# Altium project ESC.PrjPcb
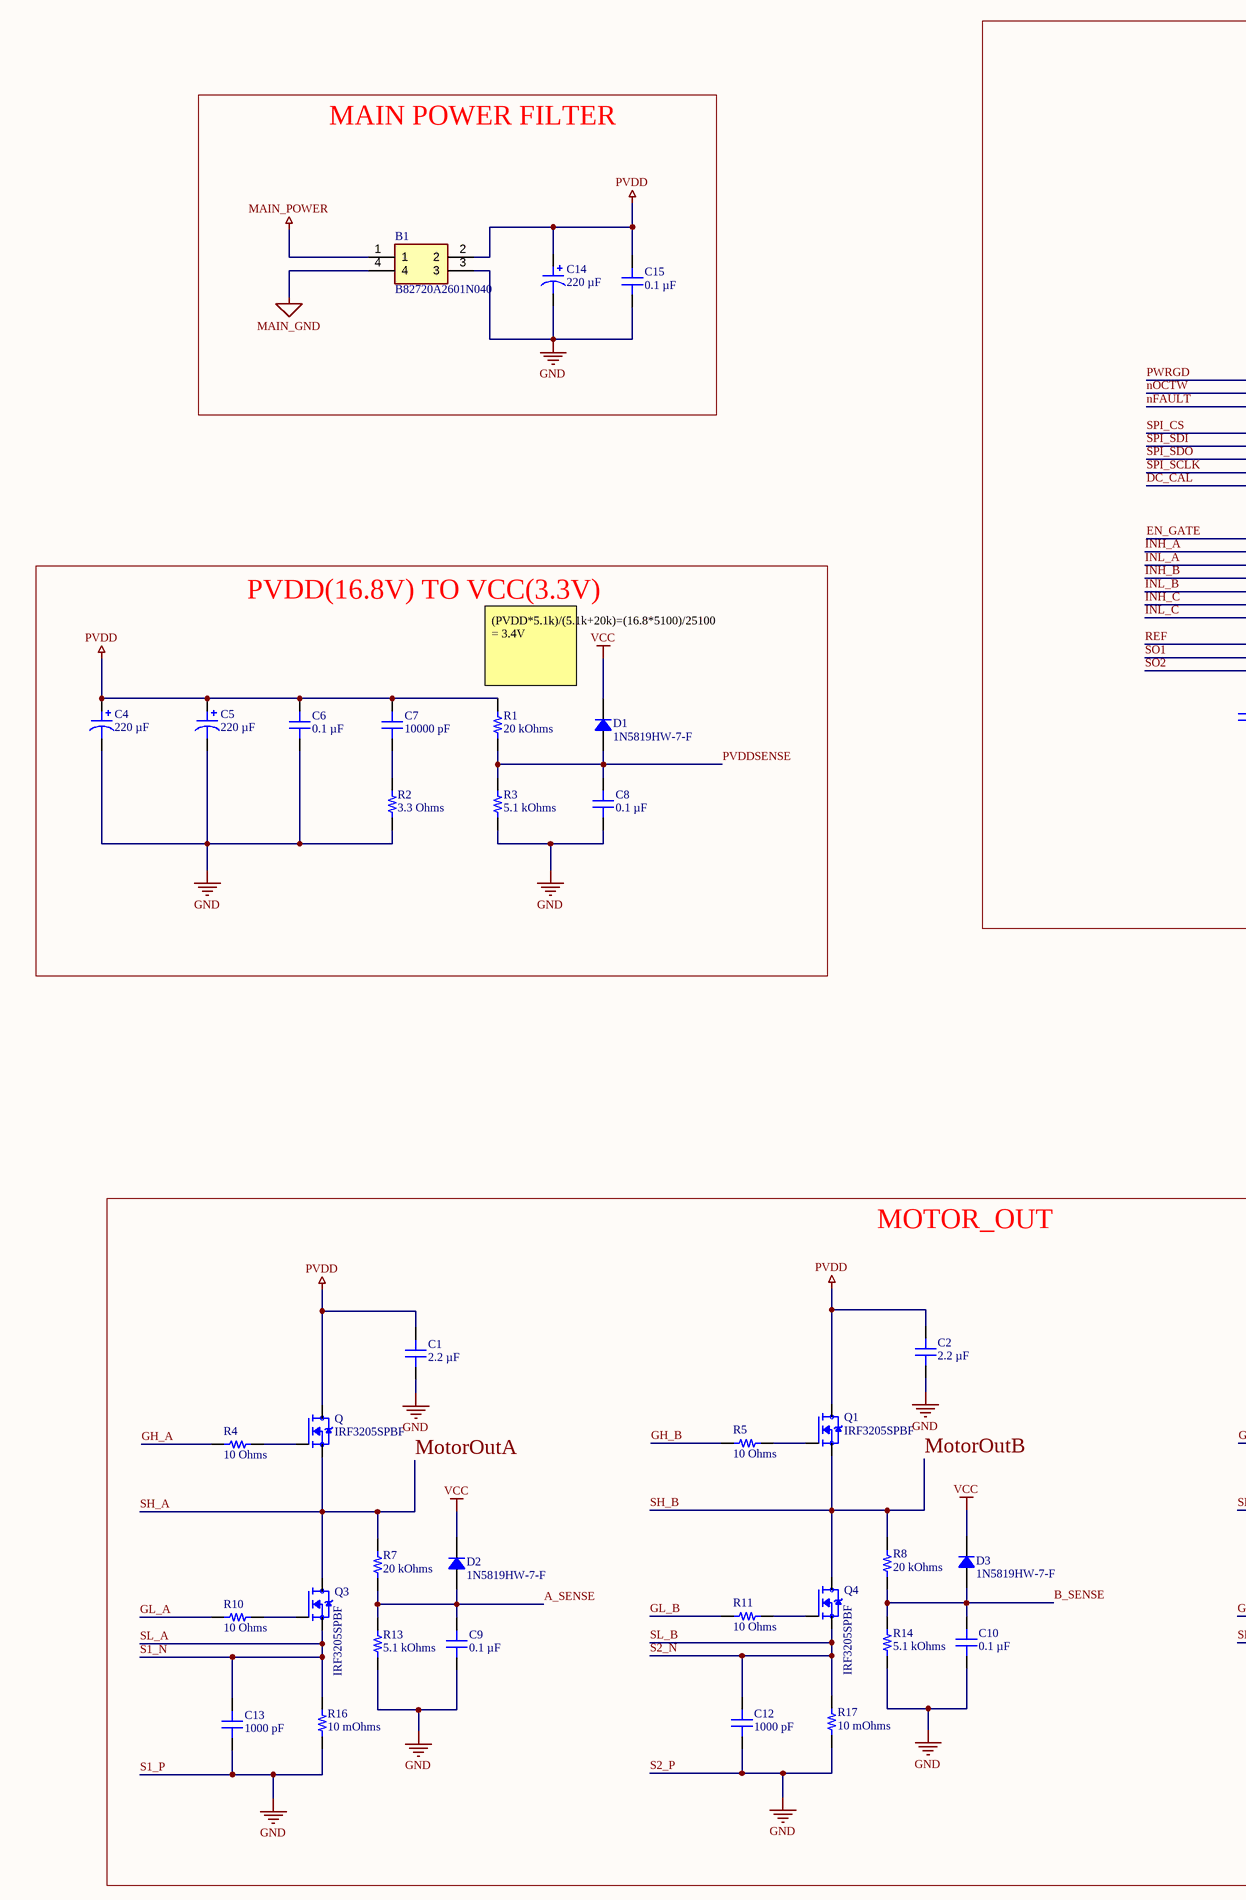
[diagram p0: Sheet1.SchDoc, left]
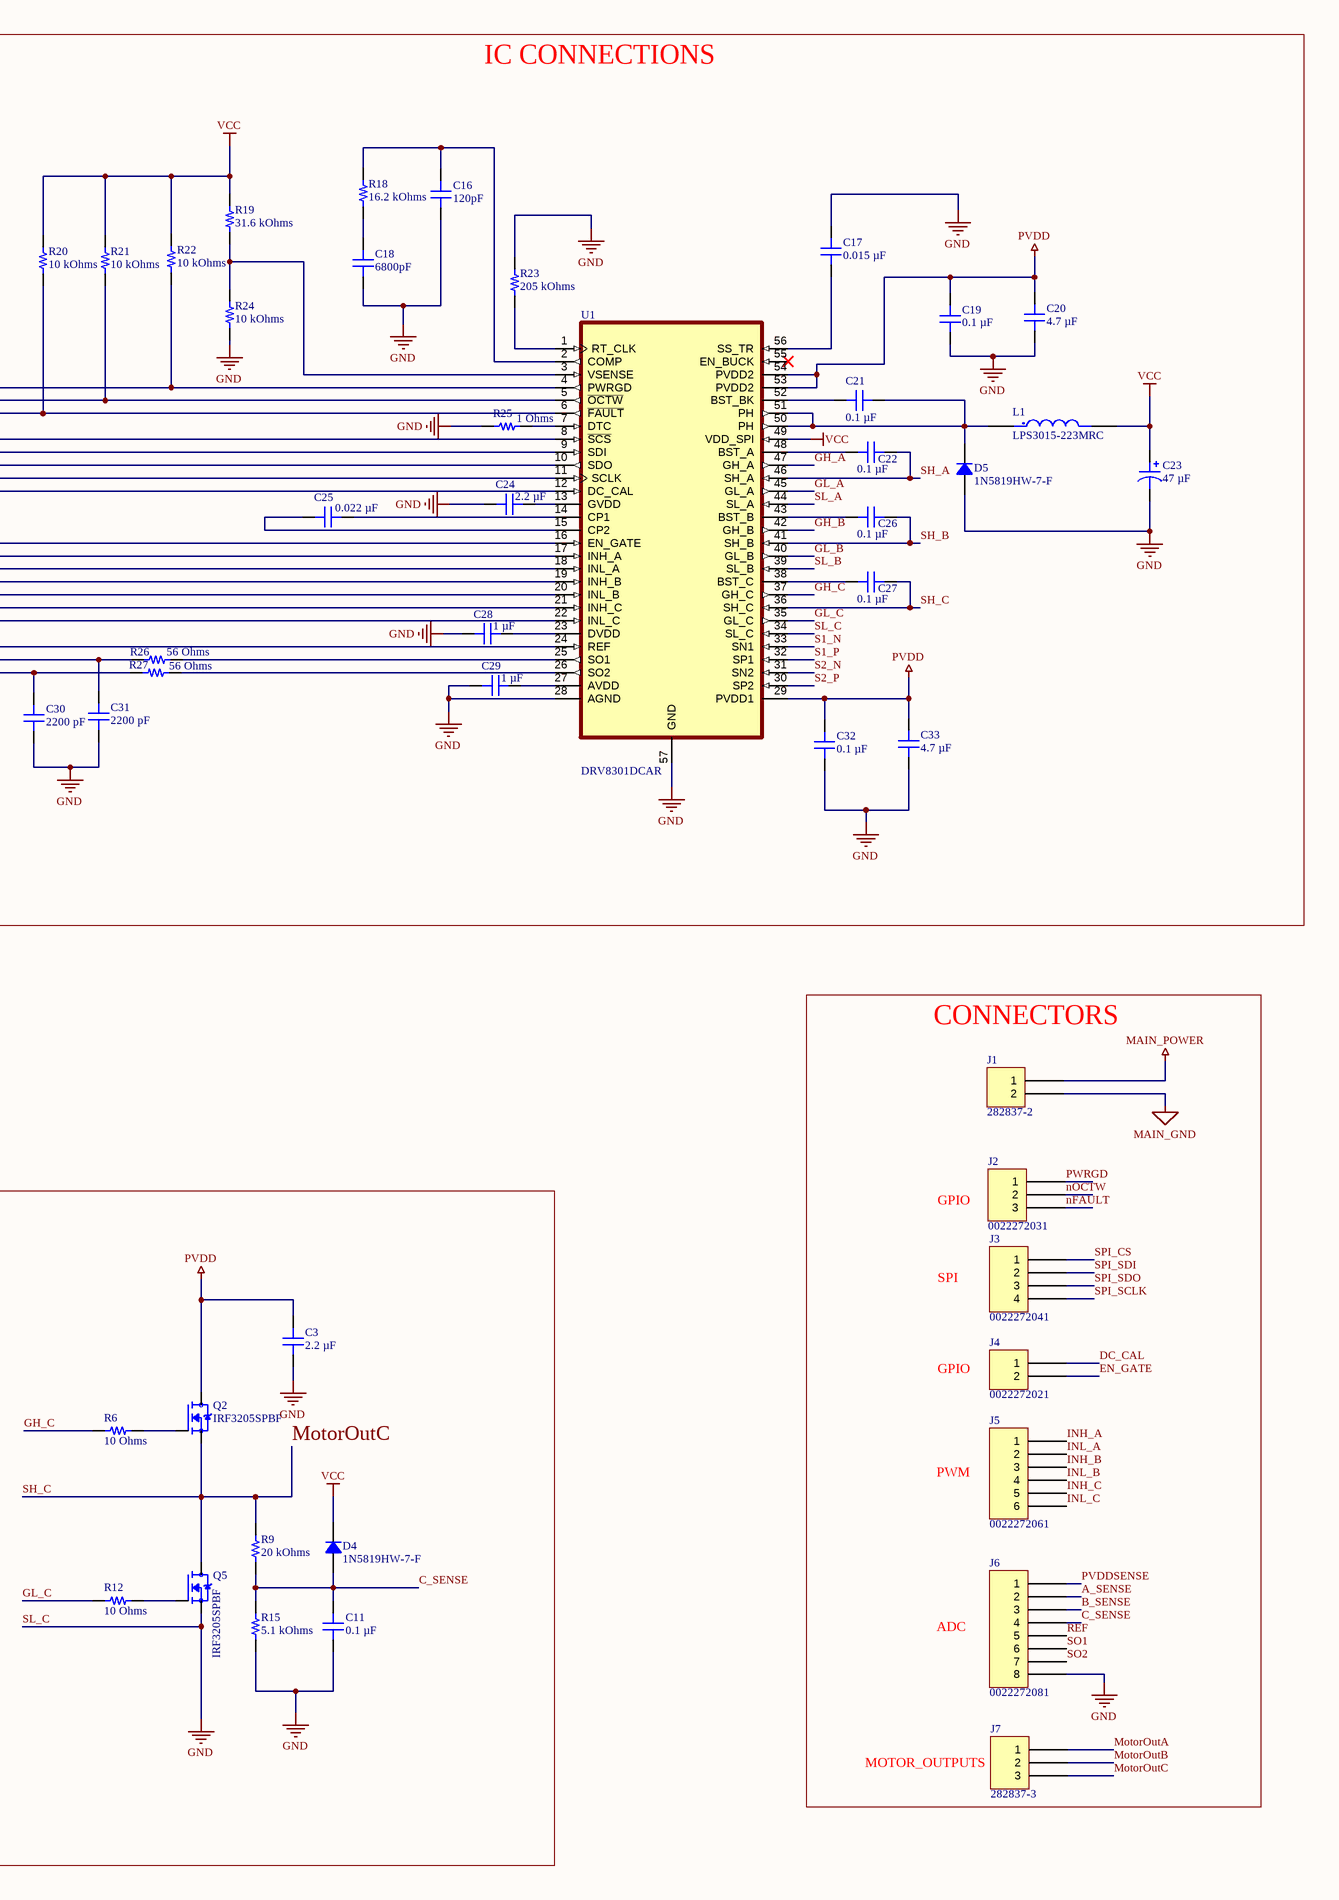
[diagram p1: Sheet1.SchDoc, right]
1 sheet, 81 parts. Net scope: global (net labels, ports and power ports of the same name join across sheets).
Board file: PCB1.PcbDoc

## Sheet Sheet1.SchDoc
size 558 x 431 mm; SheetNumber: 1; SheetTotal: 1

### Parts
B1  B82720A2601N040  [B82720A2601N040]
C1  2.2 µF  [CAP 0805_2012]
C2  2.2 µF  [CAP 0805_2012]
C3  2.2 µF  [CAP 0805_2012]
C4  220 µF  [CAP ALSMD 8.3MM H10.5MM]
C5  220 µF  [CAP ALSMD 8.3MM H10.5MM]
C6  0.1 µF  [CAP 0805_2012]
C7  10000 pF  [CAP 0805_2012]
C8  0.1 µF  [CAP 0805_2012]
C9  0.1 µF  [CAP 0805_2012]
C10  0.1 µF  [CAP 0805_2012]
C11  0.1 µF  [CAP 0805_2012]
C12  1000 pF  [CAP 0805_2012]
C13  1000 pF  [CAP 0805_2012]
C14  220 µF  [CAP ALSMD 8.3MM H10.5MM]
C15  0.1 µF  [CAP 0805_2012]
C16  120pF  [CAP 0805_2012]
C17  0.015 µF  [CAP 0805_2012]
C18  6800pF  [CAP 0805_2012]
C19  0.1 µF  [CAP 0805_2012]
C20  4.7 µF  [CAP 0805_2012]
C21  0.1 µF  [CAP 0805_2012]
C22  0.1 µF  [CAP 0805_2012]
C23  47 µF  [CAP ALSMD 8.3MM H10.5MM]
C24  2.2 µF  [CAP 0805_2012]
C25  0.022 µF  [CAP 0805_2012]
C26  0.1 µF  [CAP 0805_2012]
C27  0.1 µF  [CAP 0805_2012]
C28  1 µF  [CAP 0805_2012]
C29  1 µF  [CAP 0805_2012]
C30  2200 pF  [CAP 0805_2012]
C31  2200 pF  [CAP 0805_2012]
C32  0.1 µF  [CAP 0805_2012]
C33  4.7 µF  [CAP 0805_2012]
D1  1N5819HW-7-F  [SOD-123]
D2  1N5819HW-7-F  [SOD-123]
D3  1N5819HW-7-F  [SOD-123]
D4  1N5819HW-7-F  [SOD-123]
D5  1N5819HW-7-F  [SOD-123]
J1  282837-2  [TE 282837-2]
J2  0022272031  [MOLEX KK 0022272031]
J3  0022272041  [MOLEX KK 0022272041]
J4  0022272021  [MOLEX KK 0022272021]
J5  0022272061  [MOLEX KK 0022272061]
J6  0022272081  [MOLEX KK 0022272081]
J7  282837-3  [TE 282837-3]
L1  LPS3015-223MRC  [IND_LPS3015-223MRC]
Q  IRF3205SPBF  [D2PAK-3 (TO-263-3)]
Q1  IRF3205SPBF  [D2PAK-3 (TO-263-3)]
Q2  IRF3205SPBF  [D2PAK-3 (TO-263-3)]
Q3  IRF3205SPBF  [D2PAK-3 (TO-263-3)]
Q4  IRF3205SPBF  [D2PAK-3 (TO-263-3)]
Q5  IRF3205SPBF  [D2PAK-3 (TO-263-3)]
R1  20 kOhms  [RES 0805_2012]
R2  3.3 Ohms  [RES 0805_2012]
R3  5.1 kOhms  [RES 0805_2012]
R4  10 Ohms  [RES 0805_2012]
R5  10 Ohms  [RES 0805_2012]
R6  10 Ohms  [RES 0805_2012]
R7  20 kOhms  [RES 0805_2012]
R8  20 kOhms  [RES 0805_2012]
R9  20 kOhms  [RES 0805_2012]
R10  10 Ohms  [RES 0805_2012]
R11  10 Ohms  [RES 0805_2012]
R12  10 Ohms  [RES 0805_2012]
R13  5.1 kOhms  [RES 0805_2012]
R14  5.1 kOhms  [RES 0805_2012]
R15  5.1 kOhms  [RES 0805_2012]
R16  10 mOhms  [RES 0805_2012]
R17  10 mOhms  [RES 0805_2012]
R18  16.2 kOhms  [RES 0805_2012]
R19  31.6 kOhms  [RES 0805_2012]
R20  10 kOhms  [RES 0805_2012]
R21  10 kOhms  [RES 0805_2012]
R22  10 kOhms  [RES 0805_2012]
R23  205 kOhms  [RES 0805_2012]
R24  10 kOhms  [RES 0805_2012]
R25  1 Ohms  [RES 0805_2012]
R26  56 Ohms  [RES 0805_2012]
R27  56 Ohms  [RES 0805_2012]
U1  DRV8301DCAR  [HTSSOP-56]

### Blocks framed on the sheet
IC CONNECTIONS: C16-C33 D5 L1 R18-R27 U1
MAIN POWER FILTER: B1 C14 C15
PVDD(16.8V) TO VCC(3.3V): C4-C8 D1 R1-R3
CONNECTORS: J1-J7
MOTOR_OUT: C1-C3 C9-C13 D2-D4 Q Q1-Q5 R4-R17

### Nets
MAIN_GND: B1.4 J1.2
MAIN_POWER: B1.1 J1.1
PVDD: B1.2 C1.2 C2.2 C3.2 C4.1 C5.1 C6.2 C7.2 C14.1 C15.2 C19.2 C20.2 C32.2 C33.2 Q.2(D) Q1.2(D) Q2.2(D) R1.2 U1.29(PVDD1) U1.53(PVDD2) U1.54(PVDD2)
S1_P: B1.3 C1.1 C2.1 C3.1 C4.2 C5.2 C6.1 C8.1 C9.1 C10.1 C11.1 C12.1 C13.1 C14.2 C15.1 C16.1 C17.2 C18.1 C19.1 C20.1 C23.2 C24.1 C28.1 C29.1 C30.1 C31.1 C32.1 C33.1 D5.1 J6.8 Q5.3(S) R2.1 R3.1 R13.1 R14.1 R15.1 R16.1 R17.1 R23.2 R24.1 R25.1 U1.28(AGND) U1.30(SP2) U1.32(SP1) U1.34(SL_C) U1.57(GND)  [also labelled GND, S2_P, SL_C]
VCC: C23.1 D1.2 D2.2 D3.2 D4.2 L1.2 R19.2 R20.2 R21.2 R22.2 U1.49(VDD_SPI)
A_SENSE: C9.2 D2.1 J6.2 R7.1 R13.2
B_SENSE: C10.2 D3.1 J6.3 R8.1 R14.2
C_SENSE: C11.2 D4.1 J6.4 R9.1 R15.2
DC_CAL: J4.1 U1.12(DC_CAL)
EN_GATE: J4.2 U1.16(EN_GATE)
GH_A: R4.1 U1.47(GH_A)
GH_B: R5.1 U1.42(GH_B)
GH_C: R6.1 U1.37(GH_C)
GL_A: R10.1 U1.45(GL_A)
GL_B: R11.1 U1.40(GL_B)
GL_C: R12.1 U1.35(GL_C)
INH_A: J5.1 U1.17(INH_A)
INH_B: J5.3 U1.19(INH_B)
INH_C: J5.5 U1.21(INH_C)
INL_A: J5.2 U1.18(INL_A)
INL_B: J5.4 U1.20(INL_B)
INL_C: J5.6 U1.22(INL_C)
MotorOutA: C22.1 J7.1 Q.3(S) Q3.2(D) R7.2 U1.46(SH_A)  [also labelled SH_A]
MotorOutB: C26.1 J7.2 Q1.3(S) Q4.2(D) R8.2 U1.41(SH_B)  [also labelled SH_B]
MotorOutC: C27.1 J7.3 Q2.3(S) Q5.2(D) R9.2 U1.36(SH_C)  [also labelled SH_C]
nFAULT: J2.3 R20.1 U1.6(~{FAULT})
nOCTW: J2.2 R21.1 U1.5(~{OCTW})
PVDDSENSE: C8.2 D1.1 J6.1 R1.1 R3.2
PWRGD: J2.1 R22.1 U1.4(PWRGD)
REF: J6.5 U1.24(REF)
S1_N: C13.2 Q3.3(S) R16.2 U1.33(SN1) U1.44(SL_A)  [also labelled SL_A]
S2_N: C12.2 Q4.3(S) R17.2 U1.31(SN2) U1.39(SL_B)  [also labelled SL_B]
SO1: C31.2 J6.6 R26.1
SO2: C30.2 J6.7 R27.1
SPI_CS: J3.1 U1.8(~{SCS})
SPI_SCLK: J3.4 U1.11(SCLK)
SPI_SDI: J3.2 U1.9(SDI)
SPI_SDO: J3.3 U1.10(SDO)
NetC7_1: C7.1 R2.2
NetC16_2: C16.2 R18.2 U1.2(COMP)
NetC17_1: C17.1 U1.56(SS_TR)
NetC18_2: C18.2 R18.1
NetC21_1: C21.1 D5.2 L1.1 U1.50(PH) U1.51(PH)
NetC21_2: C21.2 U1.52(BST_BK)
NetC22_2: C22.2 U1.48(BST_A)
NetC24_2: C24.2 U1.13(GVDD)
NetC25_1: C25.1 U1.15(CP2)
NetC25_2: C25.2 U1.14(CP1)
NetC26_2: C26.2 U1.43(BST_B)
NetC27_2: C27.2 U1.38(BST_C)
NetC28_2: C28.2 U1.23(DVDD)
NetC29_2: C29.2 U1.27(AVDD)
NetQ1_1: Q1.1(G) R5.2
NetQ2_1: Q2.1(G) R6.2
NetQ3_1: Q3.1(G) R10.2
NetQ4_1: Q4.1(G) R11.2
NetQ5_1: Q5.1(G) R12.2
NetQ_1: Q.1(G) R4.2
NetR19_1: R19.1 R24.2 U1.3(VSENSE)
NetR23_1: R23.1 U1.1(RT_CLK)
NetR25_2: R25.2 U1.7(DTC)
NetR26_2: R26.2 U1.25(SO1)
NetR27_2: R27.2 U1.26(SO2)

Not connected (* = marked no-connect by the designer): U1 55(EN_BUCK)*

### Notes on the sheet
- (PVDD*5.1k)/(5.1k+20k)=(16.8*5100)/25100 = 3.4V
- GPIO
- SPI
- PWM
- ADC
- MOTOR_OUTPUTS
- DWG. NO.
- REV.
- SHT.
- REVISION
- DESCRIPTION
- DATE
- APPROVED
- THIS DOCUMENT AND THE DATA DISCLOSED HEREIN OR HEREWITH IS THE PROPERTY OF ALTIUM LIMITED AND MAY BE FREELY DISTRIBUTED IN WHOLE. NO RIGHTS ARE RESERVED OR EXPRESS OR IMPLIED WARANTEE GIVEN.
- ENG:
- DSN:
- APPROVALS
- PROJECT
- DOCUMENT REVISION:
- DESIGN ITEM:
- CHK:
- BOM:
- REFERENCE DOCUMENTS
- PROJECT REVISION:
- TITLE
- FAB DWG:
- PCB DWG:
- ASSY DWG:
- SCALE:
- SIZE
- C
- CAGE CODE
- FILE NAME
- DWG NO.
- SHEET
- OF
- REV

### Library data of the parts
B1 = B82720A2601N040: Power Line Chokes, L=4.4mH  Rated current=0.6A, LxWxT:14.2mmx14.2mmx9.6mm; Manufacturer_Name: TDK; Geometry.Height: 9.6mm; Mouser Part Number: 871-B82720A2601N40; Mouser Price/Stock: https://www.mouser.co.uk/ProductDetail/EPCOS-TDK/B82720A2601N040?qs=RhsrC5wx0u%252Bb1U4ZCcZ2fg%3D%3D; Manufacturer_Part_Number: B82720A2601N040; Datasheet Link: https://product.tdk.com/system/files/dam/doc/product/emc/emc/line-filter/data_sheet/30/db/ind_2008/b82720a_k.pdf
C1-C3 C24 = CL21A225KB9LNNC: CAP CER 2.2UF 50V X5R 0805; manufacturer: Samsung Electro-Mechanics; Tolerance: ±10%; Part Number: CL21A225KB9LNNC; Capacitance: 2.2 µF; Applications: General Purpose; componentlink1description: Datasheet; componentlink1url: http://www.samsungsem.com/kr/support/product-search/mlcc/CL21A225KB9LNNC.jsp; componentlink2description: DigiKey Link; componentlink2url: https://www.digikey.com/en/products/detail/samsung-electro-mechanics/CL21A225KB9LNNC/3888067; Device Package: 0805 (2012 Metric); Features: Low Profile; lastupdated: 9.02.2024 20:16:07; Lifecycle Status: Active; Minimum Order: 1; Mounting Type: Surface Mount, MLCC; Operating Temperature: -55°C ~ 85°C; Package / Case: 0805 (2012 Metric); packaging: TapeAndReel; partid: 3097; Part Status: Active; price: 0.04; series: CL; Size / Dimension: 0.079" L x 0.049" W (2.00mm x 1.25mm); Supplier 1: DigiKey; Supplier Part Number 1: 1276-2409-1-ND; Temperature Coefficient: X5R; Thickness (Max): 0.039" (1.00mm); value: 2.2 µF; Voltage - Rated: 50V
C4 C5 C14 = EEE-FK1V221AL: CAP ALUM 220UF 20% 35V SMD; manufacturer: Panasonic Electronic Components; Impedance: 160 mOhms; Lifetime @ Temp.: 2000 Hrs @ 105°C; Polarization: Polar; Ripple Current @ High Frequency: 600 mA @ 100 kHz; Ripple Current @ Low Frequency: 390 mA @ 120 Hz; Surface Mount Land Size: 0.327" L x 0.327" W (8.30mm x 8.30mm); Part Number: EEE-FK1V221AL; Applications: Automotive, High Temperature Reflow; Capacitance: 220 µF; componentlink1description: Datasheet; componentlink1url: https://na.industrial.panasonic.com/file-download/19649; componentlink2description: DigiKey Link; componentlink2url: https://www.digikey.com/en/products/detail/panasonic-electronic-components/EEE-FK1V221AL/12459531; Height - Seated (Max): 0.413" (10.50mm); lastupdated: 3.06.2024 20:15:43; Lifecycle Status: Active; Minimum Order: 1; Mounting Type: Surface Mount; Operating Temperature: -55°C ~ 105°C; packaging: TapeAndReel; partid: 27844; Part Status: Active; price: 0.26; Ratings: AEC-Q200; series: FK, Halogen Free; Size / Dimension: 0.315" Dia (8.00mm); Supplier 1: DigiKey; Supplier Part Number 1: 10-EEE-FK1V221ALCT-ND; Tolerance: ±20%; value: 220 µF; Voltage - Rated: 35 V
C6 C8-C11 C15 C19 C21 C22 C26 C27 C32 = CC0805MRX7R9BB104: CAP CER 0.1UF 50V X7R 0805; manufacturer: Yageo; Tolerance: ±20%; Part Number: CC0805MRX7R9BB104; Capacitance: 0.1 µF; Applications: General Purpose; componentlink1description: Datasheet; componentlink1url: https://www.yageo.com/upload/media/product/productsearch/datasheet/mlcc/UPY-GPHC_X7R_6.3V-to-50V_18.pdf; componentlink2description: DigiKey Link; componentlink2url: https://www.digikey.com/en/products/detail/yageo/CC0805MRX7R9BB104/5884281; Device Package: 0805 (2012 Metric); lastupdated: 9.02.2024 20:16:09; Lifecycle Status: Active; Minimum Order: 1; Mounting Type: Surface Mount, MLCC; Operating Temperature: -55°C ~ 125°C; Package / Case: 0805 (2012 Metric); packaging: TapeAndReel; partid: 2475; Part Status: Active; price: 0.01; series: CC; Size / Dimension: 0.079" L x 0.049" W (2.00mm x 1.25mm); Supplier 1: DigiKey; Supplier Part Number 1: 311-4351-1-ND; Temperature Coefficient: X7R; Thickness (Max): 0.037" (0.95mm); value: 0.1 µF; Voltage - Rated: 50V
C7 = C0805C103K5RECAUTO: CAP CER 0805 10NF 50V X7R 10%; manufacturer: KEMET; Part Number: C0805C103K5RECAUTO; Capacitance: 10000 pF; Applications: Automotive, ESD Protection; componentlink1description: Datasheet; componentlink1url: https://api.kemet.com/component-edge/download/datasheet/C0805C103K5RECAUTO.pdf; componentlink2description: DigiKey Link; componentlink2url: https://www.digikey.com/en/products/detail/kemet/C0805C103K5RECAUTO/8640479; Device Package: 0805 (2012 Metric); lastupdated: 9.02.2024 20:15:53; Lifecycle Status: Active; Minimum Order: 1; Mounting Type: Surface Mount, MLCC; Operating Temperature: -55°C ~ 125°C; Package / Case: 0805 (2012 Metric); packaging: TapeAndReel; partid: 8498; Part Status: Active; price: 0.04; Ratings: AEC-Q200; series: ESD SMD Auto X7R; Size / Dimension: 0.079" L x 0.049" W (2.00mm x 1.25mm); Supplier 1: DigiKey; Supplier Part Number 1: 399-17885-1-ND; Temperature Coefficient: X7R; Thickness (Max): 0.035" (0.88mm); Tolerance: ±10%; value: 10000 pF; Voltage - Rated: 50V
C12 C13 = 500R15N102JV4T: CAP CER 1000PF 50V C0G/NP0 0805; manufacturer: Johanson Dielectrics Inc.; Temperature Coefficient: C0G, NP0; Tolerance: ±5%; Part Number: 500R15N102JV4T; Capacitance: 1000 pF; Applications: General Purpose; componentlink1description: Datasheet; componentlink1url: https://www.johansondielectrics.com/downloads/catalog/johanson-dielectrics-product-catalog.pdf; componentlink2description: DigiKey Link; componentlink2url: https://www.digikey.com/en/products/detail/johanson-dielectrics-inc/500R15N102JV4T/1859425; Device Package: 0805 (2012 Metric); lastupdated: 9.02.2024 20:16:07; Lifecycle Status: Active; Minimum Order: 1; Mounting Type: Surface Mount, MLCC; Operating Temperature: -55°C ~ 125°C; Package / Case: 0805 (2012 Metric); packaging: TapeAndReel; partid: 3044; Part Status: Active; price: 0.09; series: -; Size / Dimension: 0.080" L x 0.050" W (2.03mm x 1.27mm); Supplier 1: DigiKey; Supplier Part Number 1: 709-1180-1-ND; Thickness (Max): 0.050" (1.27mm); value: 1000 pF; Voltage - Rated: 50V
C16 = 08055A121JAT2A: CAP CER 120PF 50V C0G/NP0 0805; manufacturer: AVX Corporation; Temperature Coefficient: C0G, NP0; Tolerance: ±5%; Part Number: 08055A121JAT2A; Capacitance: 120pF; Applications: General Purpose; componentlink1description: Datasheet; componentlink1url: http://datasheets.avx.com/C0GNP0-Dielectric.pdf; componentlink2description: DigiKey Link; componentlink2url: http://digikey.com/product-detail/en/avx-corporation/08055A121JAT2A/478-1317-1-ND/564349; Device Package: 0805 (2012 Metric); lastupdated: 2.09.2020 01:04:40; Lifecycle Status: Active; Minimum Order: 1; Mounting Type: Surface Mount, MLCC; Operating Temperature: -55°C ~ 125°C; Package / Case: 0805 (2012 Metric); packaging: TapeAndReel; partid: 3240; Part Status: Active; price: 0.02; series: -; Size / Dimension: 0.079" L x 0.049" W (2.01mm x 1.25mm); Supplier 1: DigiKey; Supplier Part Number 1: 478-1317-1-ND; Thickness (Max): 0.037" (0.94mm); value: 120pF; Voltage - Rated: 50V
C17 = C0805C153K5RACAUTO: CAP CER 0.015UF 50V X7R 0805; manufacturer: KEMET; Tolerance: ±10%; Part Number: C0805C153K5RACAUTO; Capacitance: 0.015 µF; Applications: Automotive, Bypass, Decoupling; componentlink1description: Datasheet; componentlink1url: https://api.kemet.com/component-edge/download/datasheet/C0805C153K5RACAUTO.pdf; componentlink2description: DigiKey Link; componentlink2url: https://www.digikey.com/en/products/detail/kemet/C0805C153K5RACAUTO/3314927; Device Package: 0805 (2012 Metric); lastupdated: 9.02.2024 20:16:09; Lifecycle Status: Active; Minimum Order: 1; Mounting Type: Surface Mount, MLCC; Operating Temperature: -55°C ~ 125°C; Package / Case: 0805 (2012 Metric); packaging: TapeAndReel; partid: 2572; Part Status: Active; price: 0.01; Ratings: AEC-Q200; series: SMD Auto X7R; Size / Dimension: 0.079" L x 0.049" W (2.00mm x 1.25mm); Supplier 1: DigiKey; Supplier Part Number 1: 399-6933-1-ND; Temperature Coefficient: X7R; Thickness (Max): 0.035" (0.88mm); value: 0.015 µF; Voltage - Rated: 50V
C18 = 08055C682KAT2A: CAP CER 6800PF 50V X7R 0805; manufacturer: AVX Corporation; Tolerance: ±10%; Part Number: 08055C682KAT2A; Capacitance: 6800pF; Applications: General Purpose; componentlink1description: Datasheet; componentlink1url: http://datasheets.avx.com/X7RDielectric.pdf; componentlink2description: DigiKey Link; componentlink2url: http://digikey.com/product-detail/en/avx-corporation/08055C682KAT2A/478-1381-1-ND/564413; Device Package: 0805 (2012 Metric); lastupdated: 2.09.2020 01:04:40; Lifecycle Status: Active; Minimum Order: 1; Mounting Type: Surface Mount, MLCC; Operating Temperature: -55°C ~ 125°C; Package / Case: 0805 (2012 Metric); packaging: TapeAndReel; partid: 3264; Part Status: Active; price: 0.02; series: -; Size / Dimension: 0.079" L x 0.049" W (2.01mm x 1.25mm); Supplier 1: DigiKey; Supplier Part Number 1: 478-1381-1-ND; Temperature Coefficient: X7R; Thickness (Max): 0.037" (0.94mm); value: 6800pF; Voltage - Rated: 50V
C20 C33 = CL21A475KBQNNNE: CAP CER 4.7UF 50V X5R 0805; manufacturer: Samsung Electro-Mechanics; Tolerance: ±10%; Part Number: CL21A475KBQNNNE; Capacitance: 4.7 µF; Applications: General Purpose; componentlink1description: Datasheet; componentlink1url: http://www.samsungsem.com/kr/support/product-search/mlcc/CL21A475KBQNNNE.jsp; componentlink2description: DigiKey Link; componentlink2url: https://www.digikey.com/en/products/detail/samsung-electro-mechanics/CL21A475KBQNNNE/3886906; Device Package: 0805 (2012 Metric); lastupdated: 9.02.2024 20:16:07; Lifecycle Status: Active; Minimum Order: 1; Mounting Type: Surface Mount, MLCC; Operating Temperature: -55°C ~ 85°C; Package / Case: 0805 (2012 Metric); packaging: TapeAndReel; partid: 3027; Part Status: Active; price: 0.03; series: CL; Size / Dimension: 0.079" L x 0.049" W (2.00mm x 1.25mm); Supplier 1: DigiKey; Supplier Part Number 1: 1276-1248-1-ND; Temperature Coefficient: X5R; Thickness (Max): 0.055" (1.40mm); value: 4.7 µF; Voltage - Rated: 50V
C23 = EEE-FK1J470P: CAP ALUM 47UF 20% 63V SMD; manufacturer: Panasonic Electronic Components; Impedance: 650 mOhms; Lifetime @ Temp.: 2000 Hrs @ 105°C; Polarization: Polar; Ripple Current @ High Frequency: 250 mA @ 100 kHz; Ripple Current @ Low Frequency: 187.5 mA @ 120 Hz; Surface Mount Land Size: 0.327" L x 0.327" W (8.30mm x 8.30mm); Part Number: EEE-FK1J470P; Applications: Automotive; Capacitance: 47 µF; componentlink2description: DigiKey Link; componentlink2url: https://www.digikey.com/en/products/detail/panasonic-electronic-components/EEE-FK1J470P/765992; Device Package: Radial, Can - SMD; Height - Seated (Max): 0.413" (10.50mm); lastupdated: 3.06.2024 20:15:49; Lifecycle Status: Active; Minimum Order: 1; Mounting Type: Surface Mount; Operating Temperature: -55°C ~ 105°C; Package / Case: Radial, Can - SMD; packaging: TapeAndReel; partid: 7482; Part Status: Active; price: 0.21; Ratings: AEC-Q200; series: FK; Size / Dimension: 0.315" Dia (8.00mm); Supplier 1: DigiKey; Supplier Part Number 1: PCE3823CT-ND; Tolerance: ±20%; value: 47 µF; Voltage - Rated: 63 V
C25 = C0805X223K5RECAUTO: CAP CER 0.022UF 50V X7R 0805; manufacturer: KEMET; Tolerance: ±10%; Part Number: C0805X223K5RECAUTO; Capacitance: 0.022 µF; Applications: Automotive, Boardflex Sensitive, ESD Protection; componentlink1description: Datasheet; componentlink1url: https://api.kemet.com/component-edge/download/datasheet/C0805X223K5RECAUTO.pdf; componentlink2description: DigiKey Link; componentlink2url: https://www.digikey.com/en/products/detail/kemet/C0805X223K5RECAUTO/8640440; Device Package: 0805 (2012 Metric); Features: Soft Termination; lastupdated: 9.02.2024 20:16:08; Lifecycle Status: Active; Minimum Order: 1; Mounting Type: Surface Mount, MLCC; Operating Temperature: -55°C ~ 125°C; Package / Case: 0805 (2012 Metric); packaging: TapeAndReel; partid: 2759; Part Status: Active; price: 0.05; Ratings: AEC-Q200; series: ESD SMD Auto X7R; Size / Dimension: 0.079" L x 0.049" W (2.00mm x 1.25mm); Supplier 1: DigiKey; Supplier Part Number 1: 399-17846-1-ND; Temperature Coefficient: X7R; Thickness (Max): 0.039" (0.98mm); value: 0.022 µF; Voltage - Rated: 50V
C28 C29 = GCJ21BR71H105KA01L: CAP CER 1UF 50V X7R 0805; manufacturer: Murata Electronics; Tolerance: ±10%; Part Number: GCJ21BR71H105KA01L; Capacitance: 1 µF; Applications: Automotive, Boardflex Sensitive; componentlink1description: Datasheet; componentlink1url: https://www.murata.com/~/media/webrenewal/support/library/catalog/products/capacitor/mlcc/c03e.ashx?la=en-us; componentlink2description: DigiKey Link; componentlink2url: https://www.digikey.com/en/products/detail/murata-electronics/GCJ21BR71H105KA01L/4903512; Device Package: 0805 (2012 Metric); Features: Soft Termination; lastupdated: 9.02.2024 20:16:08; Lifecycle Status: Active; Minimum Order: 1; Mounting Type: Surface Mount, MLCC; Operating Temperature: -55°C ~ 125°C; Package / Case: 0805 (2012 Metric); packaging: TapeAndReel; partid: 2709; Part Status: Active; price: 0.05; Ratings: AEC-Q200; series: GCJ; Size / Dimension: 0.079" L x 0.049" W (2.00mm x 1.25mm); Supplier 1: DigiKey; Supplier Part Number 1: 490-10667-1-ND; Temperature Coefficient: X7R; Thickness (Max): 0.057" (1.45mm); value: 1 µF; Voltage - Rated: 50V
C30 C31 = CC0805KRX7RABB222: CAP CER 2200PF 200V X7R 0805; manufacturer: Yageo; Tolerance: ±10%; Part Number: CC0805KRX7RABB222; Capacitance: 2200 pF; Applications: General Purpose; componentlink1description: Datasheet; componentlink1url: http://www.yageo.com/documents/recent/UPY-NP0X7R_MV_100-to-630V_21.pdf; componentlink2description: DigiKey Link; componentlink2url: https://www.digikey.com/en/products/detail/yageo/CC0805KRX7RABB222/2833648; Device Package: 0805 (2012 Metric); Features: High Voltage; lastupdated: 9.02.2024 20:16:08; Lifecycle Status: Active; Minimum Order: 1; Mounting Type: Surface Mount, MLCC; Operating Temperature: -55°C ~ 125°C; Package / Case: 0805 (2012 Metric); packaging: TapeAndReel; partid: 2589; Part Status: Active; price: 0.01; series: CC; Size / Dimension: 0.079" L x 0.049" W (2.00mm x 1.25mm); Supplier 1: DigiKey; Supplier Part Number 1: 311-1483-1-ND; Temperature Coefficient: X7R; Thickness (Max): 0.037" (0.95mm); value: 2200 pF; Voltage - Rated: 200V
D1-D5 = 1N5819HW-7-F: DIODE SCHOTTKY 40V 1A SOD123; Manufacturer: Diodes Incorporated; Capacitance @ Vr, F: 60pF @ 4V, 1MHz; Current - Reverse Leakage @ Vr: 1 mA @ 40 V; Speed: Fast Recovery =< 500ns, > 200mA (Io); Voltage - Forward (Vf) (Max) @ If: 450 mV @ 1 A; Part Number: 1N5819HW-7-F; ComponentLink1Description: Datasheet; ComponentLink1URL: https://www.diodes.com/assets/Datasheets/ds30217.pdf; ComponentLink2Description: DigiKey Link; ComponentLink2URL: https://www.digikey.com/en/products/detail/diodes-incorporated/1N5819HW-7-F/814970; Current - Average Rectified (Io): 1A; Diode Type: Schottky; LastUpdated: 3.06.2024 19:54:46; Lifecycle Status: Active; Minimum Order: 1; Mounting Type: Surface Mount; Operating Temperature - Junction: -65°C ~ 125°C; Package / Case: SOD-123; Packaging: TapeAndReel; PartId: 2212; Part Status: Active; Price: 0.05; Series: -; Supplier 1: DigiKey; Supplier Part Number 1: 1N5819HW-FDICT-ND; Supplier Device Package: SOD-123; Voltage - DC Reverse (Vr) (Max): 40 V
J1 = 282837-2: TERM BLK 2P SIDE ENT 5.08MM PCB; Manufacturer: TE Connectivity AMP Connectors; Current: 13.5 A; Mating Orientation: Horizontal with Board; Number of Levels: 1; Pitch: 0.200" (5.08mm); Positions Per Level: 2; Voltage: 300 V; Wire Gauge: 16-28 AWG; Wire Termination: Screw - Rising Cage Clamp; Part Number: 282837-2; Color: Green; ComponentLink1Description: Datasheet; ComponentLink1URL: https://www.te.com/commerce/DocumentDelivery/DDEController?Action=srchrtrv&DocNm=282837&DocType=Customer+Drawing&DocLang=English; ComponentLink2Description: DigiKey Link; ComponentLink2URL: https://www.digikey.com/en/products/detail/te-connectivity-amp-connectors/282837-2/2187973; Features: Interlocking (Side); LastUpdated: 21.06.2022 15:00:23; Lifecycle Status: Active; Minimum Order: 1; Mounting Type: Through Hole; Packaging: Tray; Part Status: Active; Price: 0.31; Series: Buchanan; Supplier 1: DigiKey; Supplier Part Number 1: A113320-ND
J2 = 0022272031: CONN HEADER VERT 3POS 2.54MM; Manufacturer: Molex; Contact Length - Mating: 0.295" (7.49mm); Contact Length - Post: 0.140" (3.56mm); Material Flammability Rating: UL94 V-0; Number of Positions: 3; Number of Positions Loaded: All; Overall Contact Length: 0.560" (14.22mm); Pitch - Mating: 0.100" (2.54mm); Shrouding: Shrouded - 1 Wall; Style: Board to Cable/Wire; Part Number: 0022272031; ComponentLink1Description: Datasheet; ComponentLink1URL: https://www.molex.com/pdm_docs/sd/022272031_sd.pdf; ComponentLink2Description: DigiKey Link; ComponentLink2URL: http://digikey.com/product-detail/en/molex/0022272031/WM4112-ND/1130578; Connector Type: Header; Contact Finish - Mating: Tin; Contact Finish - Post: Tin; Contact Finish Thickness - Mating: 100.0µin (2.54µm); Contact Material: Brass; Contact Shape: Square; Contact Type: Male Pin; Fastening Type: Friction Lock; Insulation Color: Natural; Insulation Height: 0.461" (11.70mm); Insulation Material: Polyamide (PA), Nylon; LastUpdated: 12.01.2020 23:51:54; Lifecycle Status: Active; Minimum Order: 1; Mounting Type: Through Hole; Number of Rows: 1; Packaging: Bulk; PartId: 77; Part Status: Active; Price: 0.37; Series: KK 6410; Supplier 1: DigiKey; Supplier Part Number 1: WM4112-ND; Termination: Solder
J3 = 0022272041: CONN HEADER VERT 4POS 2.54MM; Manufacturer: Molex; Contact Length - Mating: 0.295" (7.49mm); Contact Length - Post: 0.140" (3.56mm); Material Flammability Rating: UL94 V-0; Number of Positions: 4; Number of Positions Loaded: All; Overall Contact Length: 0.560" (14.22mm); Pitch - Mating: 0.100" (2.54mm); Shrouding: Shrouded - 1 Wall; Style: Board to Cable/Wire; Part Number: 0022272041; ComponentLink1Description: Datasheet; ComponentLink1URL: https://www.molex.com/pdm_docs/sd/022272041_sd.pdf; ComponentLink2Description: DigiKey Link; ComponentLink2URL: http://digikey.com/product-detail/en/molex/0022272041/WM4113-ND/1130579; Connector Type: Header; Contact Finish - Mating: Tin; Contact Finish - Post: Tin; Contact Finish Thickness - Mating: 100.0µin (2.54µm); Contact Material: Brass; Contact Shape: Square; Contact Type: Male Pin; Fastening Type: Friction Lock; Insulation Color: Natural; Insulation Height: 0.461" (11.70mm); Insulation Material: Polyamide (PA), Nylon; LastUpdated: 12.01.2020 23:52:05; Lifecycle Status: Active; Minimum Order: 1; Mounting Type: Through Hole; Number of Rows: 1; Packaging: Bulk; PartId: 78; Part Status: Active; Price: 0.40; Series: KK 6410; Supplier 1: DigiKey; Supplier Part Number 1: WM4113-ND; Termination: Solder
J4 = 0022272021: CONN HEADER VERT 2POS 2.54MM; Manufacturer: Molex; Contact Length - Mating: 0.295" (7.49mm); Contact Length - Post: 0.140" (3.56mm); Material Flammability Rating: UL94 V-0; Number of Positions: 2; Number of Positions Loaded: All; Overall Contact Length: 0.560" (14.22mm); Pitch - Mating: 0.100" (2.54mm); Shrouding: Shrouded - 1 Wall; Style: Board to Cable/Wire; Part Number: 0022272021; ComponentLink1Description: Datasheet; ComponentLink1URL: https://www.molex.com/pdm_docs/sd/022272021_sd.pdf; ComponentLink2Description: DigiKey Link; ComponentLink2URL: http://digikey.com/product-detail/en/molex/0022272021/WM4111-ND/1130577; Connector Type: Header; Contact Finish - Mating: Tin; Contact Finish - Post: Tin; Contact Finish Thickness - Mating: 100.0µin (2.54µm); Contact Material: Brass; Contact Shape: Square; Contact Type: Male Pin; Fastening Type: Friction Lock; Insulation Color: Natural; Insulation Height: 0.461" (11.70mm); Insulation Material: Polyamide (PA), Nylon; LastUpdated: 12.01.2020 23:51:43; Lifecycle Status: Active; Minimum Order: 1; Mounting Type: Through Hole; Number of Rows: 1; Packaging: Bulk; PartId: 76; Part Status: Active; Price: 0.27; Series: KK 6410; Supplier 1: DigiKey; Supplier Part Number 1: WM4111-ND; Termination: Solder
J5 = 0022272061: CONN HEADER VERT 6POS 2.54MM; Manufacturer: Molex; Contact Length - Mating: 0.295" (7.49mm); Contact Length - Post: 0.140" (3.56mm); Material Flammability Rating: UL94 V-0; Number of Positions: 6; Number of Positions Loaded: All; Overall Contact Length: 0.560" (14.22mm); Pitch - Mating: 0.100" (2.54mm); Shrouding: Shrouded - 1 Wall; Style: Board to Cable/Wire; Part Number: 0022272061; ComponentLink1Description: Datasheet; ComponentLink1URL: https://www.molex.com/pdm_docs/sd/022272061_sd.pdf; ComponentLink2Description: DigiKey Link; ComponentLink2URL: http://digikey.com/product-detail/en/molex/0022272061/WM4115-ND/1130581; Connector Type: Header; Contact Finish - Mating: Tin; Contact Finish - Post: Tin; Contact Finish Thickness - Mating: 100.0µin (2.54µm); Contact Material: Brass; Contact Shape: Square; Contact Type: Male Pin; Fastening Type: Friction Lock; Insulation Color: Natural; Insulation Height: 0.461" (11.70mm); Insulation Material: Polyamide (PA), Nylon; LastUpdated: 12.01.2020 23:52:24; Lifecycle Status: Active; Minimum Order: 1; Mounting Type: Through Hole; Number of Rows: 1; Packaging: Bulk; PartId: 80; Part Status: Active; Price: 0.49; Series: KK 6410; Supplier 1: DigiKey; Supplier Part Number 1: WM4115-ND; Termination: Solder
J6 = 0022272081: CONN HEADER VERT 8POS 2.54MM; Manufacturer: Molex; Contact Length - Mating: 0.295" (7.49mm); Contact Length - Post: 0.140" (3.56mm); Material Flammability Rating: UL94 V-0; Number of Positions: 8; Number of Positions Loaded: All; Overall Contact Length: 0.560" (14.22mm); Pitch - Mating: 0.100" (2.54mm); Shrouding: Shrouded - 1 Wall; Style: Board to Cable/Wire; Part Number: 0022272081; ComponentLink1Description: Datasheet; ComponentLink1URL: https://www.molex.com/pdm_docs/sd/022272081_sd.pdf; ComponentLink2Description: DigiKey Link; ComponentLink2URL: http://digikey.com/product-detail/en/molex/0022272081/WM4117-ND/1130583; Connector Type: Header; Contact Finish - Mating: Tin; Contact Finish - Post: Tin; Contact Finish Thickness - Mating: 100.0µin (2.54µm); Contact Material: Brass; Contact Shape: Square; Contact Type: Male Pin; Fastening Type: Friction Lock; Insulation Color: Natural; Insulation Height: 0.461" (11.70mm); Insulation Material: Polyamide (PA), Nylon; LastUpdated: 12.01.2020 23:52:41; Lifecycle Status: Active; Minimum Order: 1; Mounting Type: Through Hole; Number of Rows: 1; Packaging: Bulk; PartId: 82; Part Status: Active; Price: 0.60; Series: KK 6410; Supplier 1: DigiKey; Supplier Part Number 1: WM4117-ND; Termination: Solder
J7 = 282837-3: TERM BLK 3P SIDE ENT 5.08MM PCB; Manufacturer: TE Connectivity AMP Connectors; Current: 13.5 A; Mating Orientation: Horizontal with Board; Number of Levels: 1; Pitch: 0.200" (5.08mm); Positions Per Level: 3; Voltage: 300 V; Wire Gauge: 16-28 AWG; Wire Termination: Screw - Rising Cage Clamp; Part Number: 282837-3; Color: Green; ComponentLink1Description: Datasheet; ComponentLink1URL: https://www.te.com/commerce/DocumentDelivery/DDEController?Action=srchrtrv&DocNm=282837&DocType=Customer+Drawing&DocLang=English; ComponentLink2Description: DigiKey Link; ComponentLink2URL: https://www.digikey.com/en/products/detail/te-connectivity-amp-connectors/282837-3/2187974; Features: Interlocking (Side); LastUpdated: 21.06.2022 15:00:39; Lifecycle Status: Active; Minimum Order: 1; Mounting Type: Through Hole; Packaging: Tray; Part Status: Active; Price: 0.47; Series: Buchanan; Supplier 1: DigiKey; Supplier Part Number 1: A113321-ND
L1 = LPS3015-223MRC: 22 ÂµH Shielded - Inductor 570 mA 825mOhm Max Nonstandard -; MF: Coilcraft; SnapEDA_Link: https://www.snapeda.com/parts/LPS3015-223MRC/Coilcraft/view-part/?ref=snap; Package: None; Value: *; MP: LPS3015-223MRC; Check_prices: https://www.snapeda.com/parts/LPS3015-223MRC/Coilcraft/view-part/?ref=eda
Q Q1-Q5 = IRF3205SPBF: RoHS Compliant | Low RDS_on_ | Industry-leading quality | Dynamic dv/dt Rating | Fast Switching | Fully Avalanche Rated | 175C Operating Temperature; MF: Infineon Technologies; Package: D2PAK Infineon; Price: None; SnapEDA_Link: https://www.snapeda.com/parts/IRF3205SPBF/Infineon%20Technologies/view-part/576468/?ref=snap; Availability: Unavailable; Value: *; MP: IRF3205SPBF
R1 R7-R9 = RNCS0805BKE20K0: RES 20K OHM 0.1% 1/10W 0805; Manufacturer: Stackpole Electronics Inc; Power (Watts): 0.1W, 1/10W; Temperature Coefficient: ±25ppm/°C; Part Number: RNCS0805BKE20K0; Value: 20 kOhms; ComponentLink1Description: Datasheet; ComponentLink1URL: https://www.seielect.com/catalog/sei-rncs_rnch.pdf; ComponentLink2Description: DigiKey Link; ComponentLink2URL: https://www.digikey.com/en/products/detail/stackpole-electronics-inc/RNCS0805BKE20K0/1800080; Composition: Thin Film; Device Package: 0805 (2012 Metric); Features: Anti-Corrosive, Automotive AEC-Q200, Moisture Resistant; Height - Seated (Max): 0.026" (0.65mm); LastUpdated: 8.02.2024 21:02:27; Lifecycle Status: Active; Minimum Order: 1; Number of Terminations: 2; Operating Temperature: -55°C ~ 155°C; Package / Case: 0805 (2012 Metric); Packaging: TapeAndReel; PartId: 30413; Part Status: Active; Price: 0.07; Ratings: AEC-Q200; Resistance: 20 kOhms; Series: RNCS; Size / Dimension: 0.079" L x 0.049" W (2.00mm x 1.25mm); Supplier 1: DigiKey; Supplier Part Number 1: RNCS0805BKE20K0CT-ND; Supplier Device Package: 0805; Tolerance: ±0.1%
R2 = CRCW08053R30FKEAHP: RES SMD 3.3 OHM 1% 1/2W 0805; Manufacturer: Vishay Dale; Power (Watts): 0.5W, 1/2W; Temperature Coefficient: ±100ppm/°C; Part Number: CRCW08053R30FKEAHP; Value: 3.3 Ohms; ComponentLink1Description: Datasheet; ComponentLink1URL: http://www.vishay.com/docs/20043/crcwhpe3.pdf; ComponentLink2Description: DigiKey Link; ComponentLink2URL: https://www.digikey.com/en/products/detail/vishay-dale/CRCW08053R30FKEAHP/2226691; Composition: Thick Film; Device Package: 0805 (2012 Metric); Features: Automotive AEC-Q200, Pulse Withstanding; Height - Seated (Max): 0.020" (0.50mm); LastUpdated: 8.02.2024 21:02:35; Lifecycle Status: Active; Minimum Order: 1; Number of Terminations: 2; Operating Temperature: -55°C ~ 155°C; Package / Case: 0805 (2012 Metric); Packaging: TapeAndReel; PartId: 28521; Part Status: Active; Price: 0.03; Ratings: AEC-Q200; Resistance: 3.3 Ohms; Series: CRCW-HP; Size / Dimension: 0.079" L x 0.049" W (2.00mm x 1.25mm); Supplier 1: DigiKey; Supplier Part Number 1: 541-3.30TCT-ND; Supplier Device Package: 0805; Tolerance: ±1%
R3 R13-R15 = ERA-6AED512V: RES SMD 5.1K OHM 0.5% 1/8W 0805; Manufacturer: Panasonic Electronic Components; Power (Watts): 0.125W, 1/8W; Temperature Coefficient: ±25ppm/°C; Part Number: ERA-6AED512V; Value: 5.1 kOhms; ComponentLink1Description: Datasheet; ComponentLink1URL: https://industrial.panasonic.com/cdbs/www-data/pdf/RDM0000/AOA0000C307.pdf; ComponentLink2Description: DigiKey Link; ComponentLink2URL: https://www.digikey.com/en/products/detail/panasonic-electronic-components/ERA-6AED512V/9373625; Composition: Thin Film; Device Package: 0805 (2012 Metric); Features: Automotive AEC-Q200; Height - Seated (Max): 0.024" (0.60mm); LastUpdated: 8.02.2024 21:02:38; Lifecycle Status: Active; Minimum Order: 1; Number of Terminations: 2; Operating Temperature: -55°C ~ 155°C; Package / Case: 0805 (2012 Metric); Packaging: TapeAndReel; PartId: 27812; Part Status: Active; Price: 0.04; Ratings: AEC-Q200; Resistance: 5.1 kOhms; Series: ERA-6A; Size / Dimension: 0.079" L x 0.049" W (2.00mm x 1.25mm); Supplier 1: DigiKey; Supplier Part Number 1: P123856CT-ND; Supplier Device Package: 0805; Tolerance: ±0.5%
R4-R6 R10-R12 = RNCS0805BKE10R0: RES 10 OHM 0.1% 1/10W 0805; Manufacturer: Stackpole Electronics Inc; Power (Watts): 0.1W, 1/10W; Temperature Coefficient: ±25ppm/°C; Part Number: RNCS0805BKE10R0; Value: 10 Ohms; ComponentLink1Description: Datasheet; ComponentLink1URL: https://www.seielect.com/catalog/sei-rncs_rnch.pdf; ComponentLink2Description: DigiKey Link; ComponentLink2URL: https://www.digikey.com/en/products/detail/stackpole-electronics-inc/RNCS0805BKE10R0/1800064; Composition: Thin Film; Device Package: 0805 (2012 Metric); Features: Anti-Corrosive, Automotive AEC-Q200, Moisture Resistant; Height - Seated (Max): 0.026" (0.65mm); LastUpdated: 8.02.2024 21:02:39; Lifecycle Status: Active; Minimum Order: 1; Number of Terminations: 2; Operating Temperature: -55°C ~ 155°C; Package / Case: 0805 (2012 Metric); Packaging: TapeAndReel; PartId: 27711; Part Status: Active; Price: 0.07; Ratings: AEC-Q200; Resistance: 10 Ohms; Series: RNCS; Size / Dimension: 0.079" L x 0.049" W (2.00mm x 1.25mm); Supplier 1: DigiKey; Supplier Part Number 1: RNCS0805BKE10R0CT-ND; Supplier Device Package: 0805; Tolerance: ±0.1%
R16 R17 = PMR10EZPJU10L: RES 0.01 OHM 5% 1/2W 0805; Manufacturer: Rohm Semiconductor; Power (Watts): 0.5W, 1/2W; Temperature Coefficient: ±150ppm/°C; Part Number: PMR10EZPJU10L; Value: 10 mOhms; ComponentLink1Description: Datasheet; ComponentLink1URL: https://www.rohm.com/datasheet/PMR18EZPFV/pmr-e; ComponentLink2Description: DigiKey Link; ComponentLink2URL: https://www.digikey.com/en/products/detail/rohm-semiconductor/PMR10EZPJU10L/2094193; Composition: Metal Element; Device Package: 0805 (2012 Metric); Features: Automotive AEC-Q200, Current Sense; Height - Seated (Max): 0.019" (0.47mm); LastUpdated: 8.02.2024 21:01:47; Lifecycle Status: Active; Minimum Order: 1; Number of Terminations: 2; Operating Temperature: -55°C ~ 155°C; Package / Case: 0805 (2012 Metric); Packaging: TapeAndReel; PartId: 40125; Part Status: Active; Price: 0.17; Ratings: AEC-Q200; Resistance: 10 mOhms; Series: PMR; Size / Dimension: 0.079" L x 0.047" W (2.00mm x 1.20mm); Supplier 1: DigiKey; Supplier Part Number 1: RHM.010AKCT-ND; Supplier Device Package: 0805; Tolerance: ±5%
R18 = RA73F2A16K2BTD: RA73F 2A 16K2 0.1% 5K RL; Manufacturer: TE Connectivity Passive Product; Power (Watts): 1W; Temperature Coefficient: 25ppm/°C; Part Number: RA73F2A16K2BTD; Value: 16.2 kOhms; ComponentLink1Description: Datasheet; ComponentLink1URL: https://www.te.com/commerce/DocumentDelivery/DDEController?Action=srchrtrv&DocNm=1773270-3&DocType=DS&DocLang=English; ComponentLink2Description: DigiKey Link; ComponentLink2URL: https://www.digikey.com/en/products/detail/te-connectivity-passive-product/RA73F2A16K2BTD/16031474; Composition: Thin Film; Device Package: 0805 (2012 Metric); Height - Seated (Max): 0.023" (0.58mm); LastUpdated: 8.02.2024 21:00:18; Lifecycle Status: Active; Minimum Order: 1; Number of Terminations: 2; Operating Temperature: -55°C ~ 155°C; Package / Case: 0805 (2012 Metric); Packaging: TapeAndReel; PartId: 74262; Part Status: Active; Price: 0.48; Resistance: 16.2 kOhms; Series: RA73; Size / Dimension: 0.079" L x 0.049" W (2.00mm x 1.25mm); Supplier 1: DigiKey; Supplier Part Number 1: 1712-RA73F2A16K2BTDCT-ND; Supplier Device Package: 0805; Tolerance: ±0.1%
R19 = RN73C2A31K6BTDF: RES SMD 31.6KOHM 0.1% 1/10W 0805; Manufacturer: TE Connectivity Passive Product; Power (Watts): 0.1W, 1/10W; Temperature Coefficient: ±10ppm/°C; Part Number: RN73C2A31K6BTDF; Value: 31.6 kOhms; ComponentLink1Description: Datasheet; ComponentLink1URL: https://www.te.com/commerce/DocumentDelivery/DDEController?Action=srchrtrv&DocNm=1773270&DocType=DS&DocLang=English; ComponentLink2Description: DigiKey Link; ComponentLink2URL: https://www.digikey.com/en/products/detail/te-connectivity-passive-product/RN73C2A31K6BTDF/2374220; Composition: Thin Film; Device Package: 0805 (2012 Metric); Height - Seated (Max): 0.026" (0.65mm); LastUpdated: 8.02.2024 21:02:37; Lifecycle Status: Active; Minimum Order: 1; Number of Terminations: 2; Operating Temperature: -55°C ~ 155°C; Package / Case: 0805 (2012 Metric); Packaging: TapeAndReel; PartId: 27984; Part Status: Active; Price: 0.36; Resistance: 31.6 kOhms; Series: RN73, Holsworthy; Size / Dimension: 0.079" L x 0.049" W (2.00mm x 1.25mm); Supplier 1: DigiKey; Supplier Part Number 1: A103408CT-ND; Supplier Device Package: 0805; Tolerance: ±0.1%
R20-R22 R24 = RNCS0805BKE10K0: RES 10K OHM 0.1% 1/10W 0805; Manufacturer: Stackpole Electronics Inc; Power (Watts): 0.1W, 1/10W; Temperature Coefficient: ±25ppm/°C; Part Number: RNCS0805BKE10K0; Value: 10 kOhms; ComponentLink1Description: Datasheet; ComponentLink1URL: https://www.seielect.com/catalog/sei-rncs_rnch.pdf; ComponentLink2Description: DigiKey Link; ComponentLink2URL: https://www.digikey.com/en/products/detail/stackpole-electronics-inc/RNCS0805BKE10K0/1800067; Composition: Thin Film; Device Package: 0805 (2012 Metric); Features: Anti-Corrosive, Automotive AEC-Q200, Moisture Resistant; Height - Seated (Max): 0.026" (0.65mm); LastUpdated: 8.02.2024 21:02:39; Lifecycle Status: Active; Minimum Order: 1; Number of Terminations: 2; Operating Temperature: -55°C ~ 155°C; Package / Case: 0805 (2012 Metric); Packaging: TapeAndReel; PartId: 27713; Part Status: Active; Price: 0.07; Ratings: AEC-Q200; Resistance: 10 kOhms; Series: RNCS; Size / Dimension: 0.079" L x 0.049" W (2.00mm x 1.25mm); Supplier 1: DigiKey; Supplier Part Number 1: RNCS0805BKE10K0CT-ND; Supplier Device Package: 0805; Tolerance: ±0.1%
R23 = CRCW0805205KFKEA: RES SMD 205K OHM 1% 1/8W 0805; Manufacturer: Vishay Dale; Power (Watts): 0.125W, 1/8W; Temperature Coefficient: ±100ppm/°C; Part Number: CRCW0805205KFKEA; Value: 205 kOhms; ComponentLink1Description: Datasheet; ComponentLink1URL: http://www.vishay.com/docs/20035/dcrcwe3.pdf; ComponentLink2Description: DigiKey Link; ComponentLink2URL: https://www.digikey.com/en/products/detail/vishay-dale/CRCW0805205KFKEA/1175898; Composition: Thick Film; Device Package: 0805 (2012 Metric); Features: Automotive AEC-Q200; Height - Seated (Max): 0.020" (0.50mm); LastUpdated: 8.02.2024 21:02:16; Lifecycle Status: Active; Minimum Order: 1; Number of Terminations: 2; Operating Temperature: -55°C ~ 155°C; Package / Case: 0805 (2012 Metric); Packaging: TapeAndReel; PartId: 32865; Part Status: Active; Price: 0.01; Ratings: AEC-Q200; Resistance: 205 kOhms; Series: CRCW; Size / Dimension: 0.079" L x 0.049" W (2.00mm x 1.25mm); Supplier 1: DigiKey; Supplier Part Number 1: 541-205KCCT-ND; Supplier Device Package: 0805; Tolerance: ±1%
R25 = RL1220S-1R0-F: RES SMD 1 OHM 1% 1/3W 0805; Manufacturer: Susumu; Power (Watts): 0.333W, 1/3W; Temperature Coefficient: 0/ +200ppm/°C; Part Number: RL1220S-1R0-F; Value: 1 Ohms; ComponentLink1Description: Datasheet; ComponentLink1URL: http://www.susumu.co.jp/common/pdf/n_catalog_partition08_en.pdf; ComponentLink2Description: DigiKey Link; ComponentLink2URL: https://www.digikey.com/en/products/detail/susumu/RL1220S-1R0-F/432493; Composition: Thin Film; Device Package: 0805 (2012 Metric); Features: Current Sense; Height - Seated (Max): 0.020" (0.50mm); LastUpdated: 8.02.2024 21:02:37; Lifecycle Status: Active; Minimum Order: 1; Number of Terminations: 2; Operating Temperature: -55°C ~ 125°C; Package / Case: 0805 (2012 Metric); Packaging: TapeAndReel; PartId: 28053; Part Status: Active; Price: 0.03; Resistance: 1 Ohms; Series: RL; Size / Dimension: 0.079" L x 0.049" W (2.00mm x 1.25mm); Supplier 1: DigiKey; Supplier Part Number 1: RL12S1.00FCT-ND; Supplier Device Package: 0805; Tolerance: ±1%
R26 R27 = ERA-6AEB560V: RES SMD 56 OHM 0.1% 1/8W 0805; Manufacturer: Panasonic Electronic Components; Power (Watts): 0.125W, 1/8W; Temperature Coefficient: ±25ppm/°C; Part Number: ERA-6AEB560V; Value: 56 Ohms; ComponentLink1Description: Datasheet; ComponentLink1URL: https://industrial.panasonic.com/cdbs/www-data/pdf/RDM0000/AOA0000C307.pdf; ComponentLink2Description: DigiKey Link; ComponentLink2URL: https://www.digikey.com/en/products/detail/panasonic-electronic-components/ERA-6AEB560V/1465718; Composition: Thin Film; Device Package: 0805 (2012 Metric); Features: Automotive AEC-Q200; Height - Seated (Max): 0.024" (0.60mm); LastUpdated: 8.02.2024 21:02:37; Lifecycle Status: Active; Minimum Order: 1; Number of Terminations: 2; Operating Temperature: -55°C ~ 155°C; Package / Case: 0805 (2012 Metric); Packaging: TapeAndReel; PartId: 28149; Part Status: Active; Price: 0.03; Ratings: AEC-Q200; Resistance: 56 Ohms; Series: ERA-6A; Size / Dimension: 0.079" L x 0.049" W (2.00mm x 1.25mm); Supplier 1: DigiKey; Supplier Part Number 1: P56DACT-ND; Supplier Device Package: 0805; Tolerance: ±0.1%
U1 = DRV8301DCAR: GATE DRIVER FOR BRUSHLESS DC  MOTORS; MF: Texas Instruments; Package: HTSSOP-56 Texas Instruments; Value: *; Digi-Key_Purchase_URL: https://www.digikey.com.cn/product-detail/zh/texas-instruments/DRV8301DCAR/296-29433-1-ND/2743170?utm_source=snapeda&utm_medium=aggregator&utm_campaign=symbol; Digi-Key_Part_Number: 296-29433-1-ND; MP: DRV8301DCAR; SnapEDA_Link: https://www.snapeda.com/parts/DRV8301DCAR/Texas%20Instruments/view-part/46687/?ref=snap